# Altium schematic sheet OLED.SchDoc: RaspberryPi_Hat
size A4; Revision: V0.1; SheetNumber: X; SheetTotal: Y; Function: OLED; number: 2; totle: 3
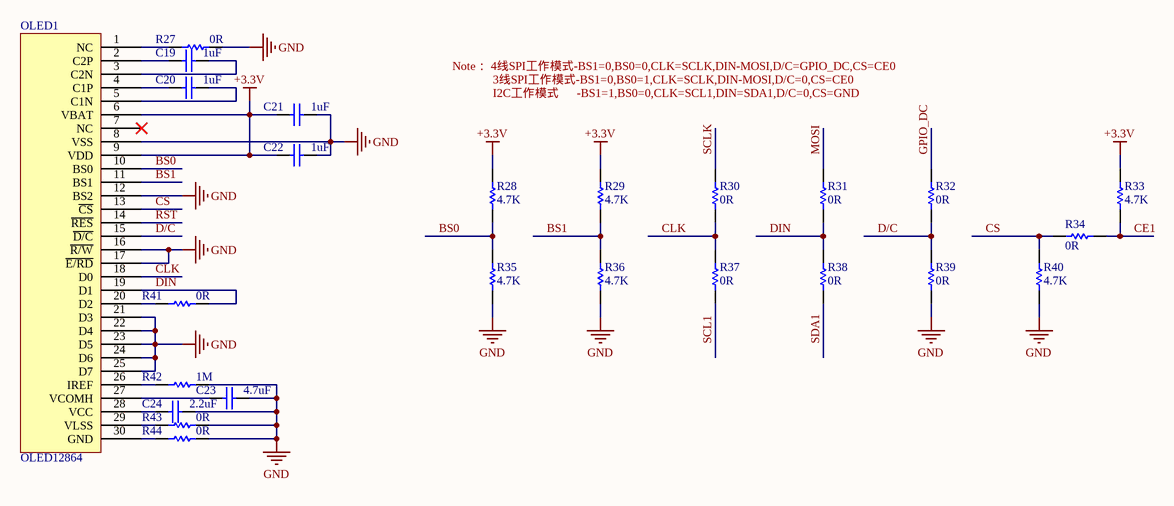
[diagram p0: OLED.SchDoc]

## Parts
C19  1uF  [C0603]
C20  1uF  [C0603]
C21  1uF  [C0603]
C22  1uF  [C0603]
C23  4.7uF  [C0603]
C24  2.2uF  [C0603]
OLED1  OLED12864  [OLED_128*64_0.96_30PIN]
R27  0R  [R0603]
R28  4.7K  [R0603]
R29  4.7K  [R0603]
R30  0R  [R0603]
R31  0R  [R0603]
R32  0R  [R0603]
R33  4.7K  [R0603]
R34  0R  [R0603]
R35  4.7K  [R0603]
R36  4.7K  [R0603]
R37  0R  [R0603]
R38  0R  [R0603]
R39  0R  [R0603]
R40  4.7K  [R0603]
R41  0R  [R0603]
R42  1M  [R0603]
R43  0R  [R0603]
R44  0R  [R0603]

## Nets
+3.3V: C21.2 C22.2 OLED1.6(VBAT) OLED1.9(VDD) R28.1 R29.1 R33.1
GND: C21.1 C22.1 C23.1 C24.1 OLED1.8(VSS) OLED1.12(BS2) OLED1.16(~{R/W}) OLED1.17(~{E/RD}) OLED1.21(D3) OLED1.22(D4) OLED1.23(D5) OLED1.24(D6) OLED1.25(D7) R27.1 R35.2 R36.2 R39.2 R40.2 R42.1 R43.1 R44.1
BS0: OLED1.10(BS0) R28.2 R35.1
BS1: OLED1.11(BS1) R29.2 R36.1
CE1: R33.2 R34.2
CLK: OLED1.18(D0) R30.2 R37.1
CS: OLED1.13(~{CS}) R34.1 R40.1
D/C: OLED1.15(~{D/C}) R32.2 R39.1
DIN: OLED1.19(D1) R31.2 R38.1 R41.1
GPIO_DC: R32.1
MOSI: R31.1
RST: OLED1.14(~{RES})
SCL1: R37.2
SCLK: R30.1
SDA1: R38.2
NetC19_1: C19.1 OLED1.3(C2N)
NetC19_2: C19.2 OLED1.2(C2P)
NetC20_1: C20.1 OLED1.5(C1N)
NetC20_2: C20.2 OLED1.4(C1P)
NetC23_2: C23.2 OLED1.27(VCOMH)
NetC24_2: C24.2 OLED1.28(VCC)
NetOLED1_1: OLED1.1(NC) R27.2
NetOLED1_20: OLED1.20(D2) R41.2
NetOLED1_26: OLED1.26(IREF) R42.2
NetOLED1_29: OLED1.29(VLSS) R43.2
NetOLED1_30: OLED1.30(GND) R44.2

Not connected (* = marked no-connect by the designer): OLED1 7(NC)*

## Notes on the sheet
- Note： 4线SPI工作模式-BS1=0,BS0=0,CLK=SCLK,DIN-MOSI,D/C=GPIO_DC,CS=CE0
- 3线SPI工作模式-BS1=0,BS0=1,CLK=SCLK,DIN-MOSI,D/C=0,CS=CE0
- I2C工作模式      -BS1=1,BS0=0,CLK=SCL1,DIN=SDA1,D/C=0,CS=GND
- 工程名称：
- 图纸大小：
- 日期：
- A4
- 版本号：
- 页码：
- 第
- 共
- 制图：
- 审核：

## Library data of the parts
C19-C24 = Cap Semi: Capacitor (Semiconductor SIM Model); Published: 8-Jun-2000; LatestRevisionDate: 29-May-2009; LatestRevisionNote: IPC-7351 Footprint Added.; PackageReference: C1206; Publisher: Altium Limited; PackageDescription: Chip Capacitor
  C19-C22: Value: 1uF
  C23: Value: 4.7uF
  C24: Value: 2.2uF
OLED1 = OLED12864: OLED 12864 0.9inch
R27-R44 = Res1: Resistor; Published: 8-Jun-2000; LatestRevisionDate: 17-Jul-2002; LatestRevisionNote: Re-released for DXP Platform.; PackageReference: AXIAL-0.3; Publisher: Altium Limited; PackageDescription: Axial Device, Thru-Hole; 2 Leads; 0.3 in Pin Spacing
  R27 R30-R32 R34 R37-R39 R41 R43 R44: Value: 0R
  R28 R29 R33 R35 R36 R40: Value: 4.7K
  R42: Value: 1M